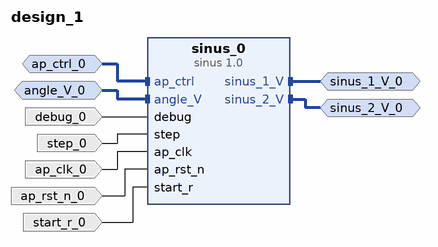
[diagram p0: block diagram of the top level]
# Vivado block design design_1, xc7z020clg484-1, Vivado 2020.2
create_bd_design design_1

create_bd_intf_port -mode Slave -vlnv xilinx.com:interface:acc_handshake_rtl:1.0 ap_ctrl_0
create_bd_intf_port -mode Master -vlnv xilinx.com:interface:axis_rtl:1.0 sinus_1_V_0
create_bd_intf_port -mode Slave -vlnv xilinx.com:interface:axis_rtl:1.0 angle_V_0
set_property -dict [list \
  CONFIG.HAS_TKEEP 0 \
  CONFIG.HAS_TLAST 0 \
  CONFIG.HAS_TREADY 1 \
  CONFIG.HAS_TSTRB 0 \
  CONFIG.LAYERED_METADATA undef \
  CONFIG.TDATA_NUM_BYTES 4 \
  CONFIG.TDEST_WIDTH 0 \
  CONFIG.TID_WIDTH 0 \
  CONFIG.TUSER_WIDTH 0 \
] [get_bd_intf_ports angle_V_0]
create_bd_intf_port -mode Master -vlnv xilinx.com:interface:axis_rtl:1.0 sinus_2_V_0
create_bd_port -dir I -type data debug_0
create_bd_port -dir I -type data step_0
create_bd_port -dir I -type clk ap_clk_0
create_bd_port -dir I -type rst ap_rst_n_0
create_bd_port -dir I -type data start_r_0

create_bd_cell -type ip -vlnv xilinx.com:hls:sinus:1.0 sinus_0

# ---- connections ----

connect_bd_intf_net -intf_net ap_ctrl_0_1 [get_bd_intf_ports ap_ctrl_0] [get_bd_intf_pins sinus_0/ap_ctrl]
connect_bd_intf_net [get_bd_intf_ports sinus_1_V_0] [get_bd_intf_pins sinus_0/sinus_1_V]
connect_bd_intf_net [get_bd_intf_ports sinus_2_V_0] [get_bd_intf_pins sinus_0/sinus_2_V]
connect_bd_intf_net -intf_net angle_V_0_1 [get_bd_intf_ports angle_V_0] [get_bd_intf_pins sinus_0/angle_V]
connect_bd_net -net debug_0_1 [get_bd_ports debug_0] [get_bd_pins sinus_0/debug]
connect_bd_net -net step_0_1 [get_bd_ports step_0] [get_bd_pins sinus_0/step]
connect_bd_net -net ap_clk_0_1 [get_bd_ports ap_clk_0] [get_bd_pins sinus_0/ap_clk]
connect_bd_net -net ap_rst_n_0_1 [get_bd_ports ap_rst_n_0] [get_bd_pins sinus_0/ap_rst_n]
connect_bd_net -net start_r_0_1 [get_bd_ports start_r_0] [get_bd_pins sinus_0/start_r]

validate_bd_design
save_bd_design
